# Altium project ElectroSmithES2164.PrjPcb
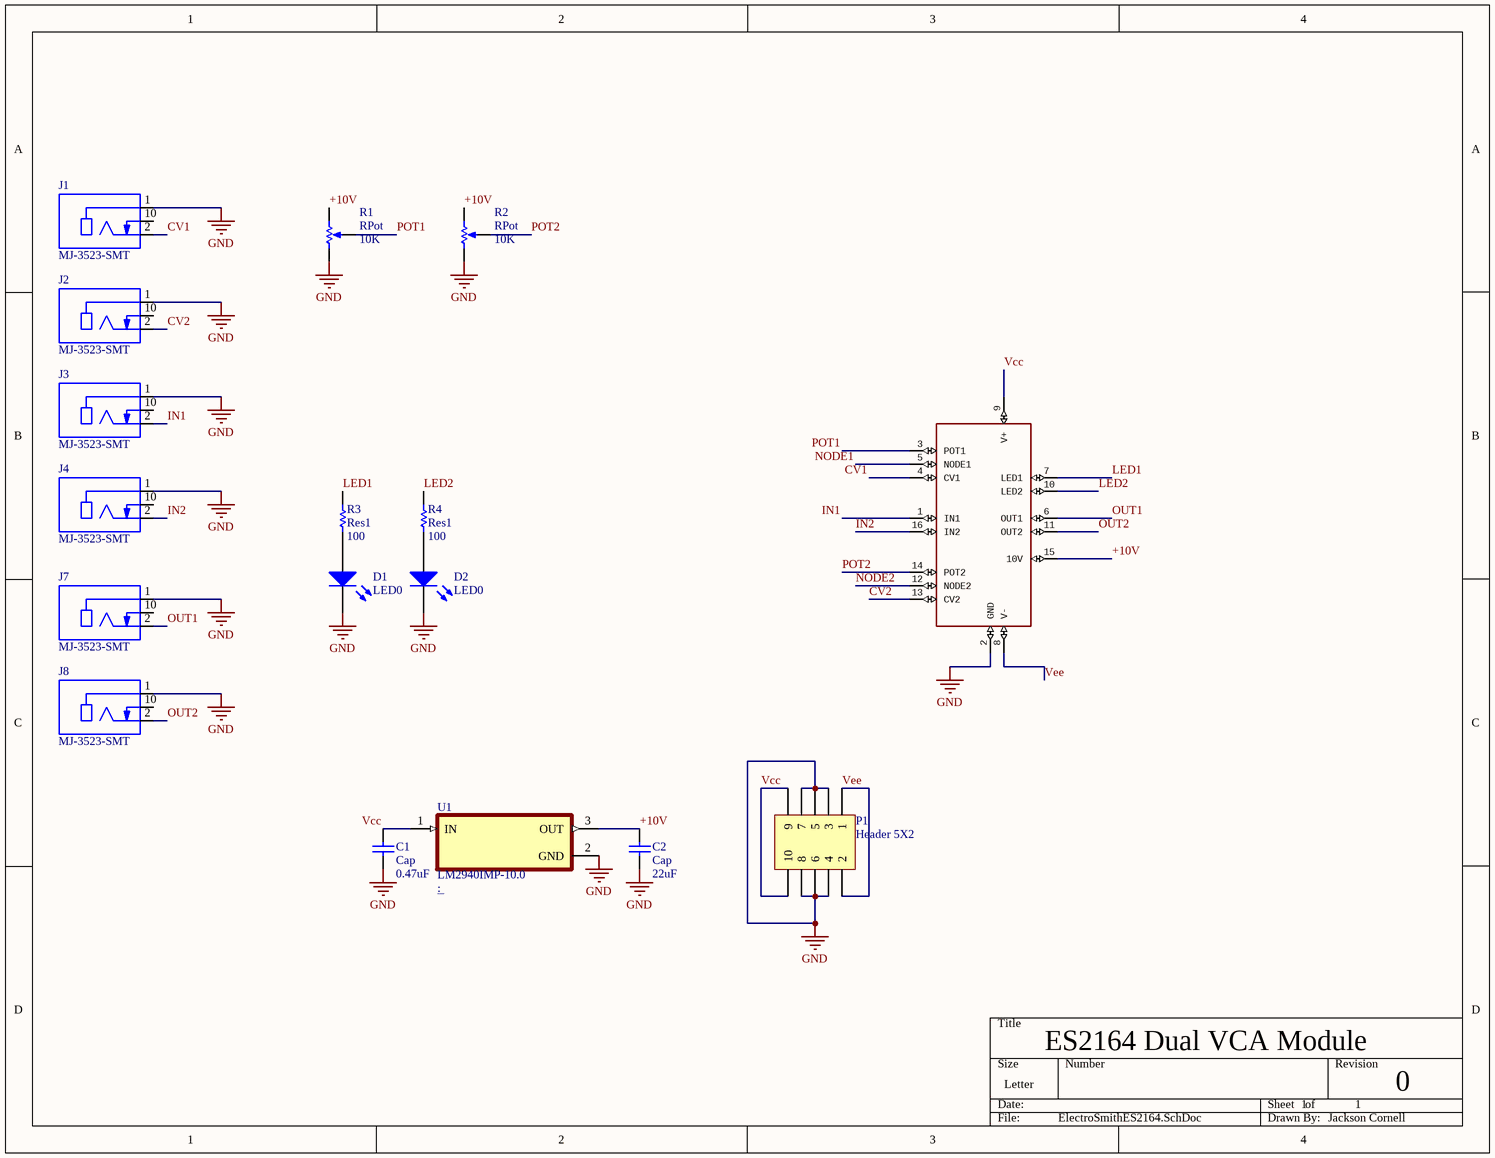
[diagram p0: ElectroSmithES2164.SchDoc]
1 sheet, 17 parts. Net scope: global (net labels, ports and power ports of the same name join across sheets).
Board file: ElectroSmithES2164.PcbDoc

## Sheet ElectroSmithES2164.SchDoc
size Letter

### Parts
C1  Cap  value 0.47uF  [RESC3115X65N]
C2  Cap  value 22uF  [RESC3115X65N]
D1  LED0  [LED-0]
D2  LED0  [LED-0]
J1  MJ-3523-SMT  [ES 3.5mm Jack]
J2  MJ-3523-SMT  [ES 3.5mm Jack]
J3  MJ-3523-SMT  [ES 3.5mm Jack]
J4  MJ-3523-SMT  [ES 3.5mm Jack]
J7  MJ-3523-SMT  [ES 3.5mm Jack]
J8  MJ-3523-SMT  [ES 3.5mm Jack]
P1  Header 5X2  [HDR2X5]
R1  RPot  value 10K  [ES Potentiometer]
R2  RPot  value 10K  [ES Potentiometer]
R3  Res1  value 100  [RESC3115X65N]
R4  Res1  value 100  [RESC3115X65N]
U1  LM2940IMP-10.0  [SOT230P700X180-4N]
U?  Designed for ES_2164_Rev4  [ES_2164_V2]  (value not drawn)

### Nets
GND: C1.2 C2.2 D1.2(K) D2.2(K) J1.1 J2.1 J3.1 J4.1 J7.1 J8.1 P1.3 P1.4 P1.5 P1.6 P1.7 P1.8 R1.1(TOP) R2.1(TOP) U1.2(GND) U?.2(GND)
+10V: C2.1 R1.2(BOT) R2.2(BOT) U1.3(OUT) U?.15(10V)
CV1: J1.2 U?.4(CV1)
CV2: J2.2 U?.13(CV2)
IN1: J3.2 U?.1(IN1)
IN2: J4.2 U?.16(IN2)
LED1: R3.2 U?.7(LED1)
LED2: R4.2 U?.10(LED2)
NODE1: U?.5(NODE1)
NODE2: U?.12(NODE2)
OUT1: J7.2 U?.6(OUT1)
OUT2: J8.2 U?.11(OUT2)
POT1: R1.3(TAP) U?.3(POT1)
POT2: R2.3(TAP) U?.14(POT2)
Vcc: C1.1 P1.9 P1.10 U1.1(IN) U?.9(V+)
Vee: P1.1 P1.2 U?.8(V-)
NetD1_1: D1.1(A) R3.1
NetD2_1: D2.1(A) R4.1

Not connected (* = marked no-connect by the designer): J1 10; J2 10; J3 10; J4 10; J7 10; J8 10

### Notes on the sheet
- ES2164 Dual VCA Module
- 1
- 0
- Jackson Cornell

### Library data of the parts
C1 C2 = Cap: Capacitor; Published: 8-Jun-2000; LatestRevisionDate: 17-Jul-2002; LatestRevisionNote: Re-released for DXP Platform.; PackageReference: RAD-0.3; Publisher: Altium Limited; PackageDescription: Radial Cap, Thru-Hole; 2 Leads; 0.3 in Pin Spacing
D1 D2 = LED0: Typical INFRARED GaAs LED; Published: 8-Jun-2000; LatestRevisionDate: 08-Jul-2005; LatestRevisionNote: Mech Layer 1 removed.; PackageReference: LED-0; Publisher: Altium Limited; PackageDescription: LED; 2 Leads
J1-J4 J7 J8 = MJ-3523-SMT: 3.5 mm, Mono, Right Angle, Surface Mount _SMT_, Audio Jack Connector; MP: MJ-3523-SMT-TR; MF: CUI Devices; CUI_purchase_URL: https://www.cuidevices.com/product/interconnect/connectors/audio-connectors/jacks/mj-3523-smt?utm_source=snapeda.com&utm_medium=referral&utm_campaign=snapedaBOM; Package: None; Price: None; Availability: Unavailable; Value: *; SnapEDA_Link: https://www.snapeda.com/parts/MJ-3523-SMT-TR/CUI%20Devices/view-part/522855/?ref=snap
P1 = Header 5X2: Header, 5-Pin, Dual row; LatestRevisionDate: 17-Jul-2002; LatestRevisionNote: Re-released for DXP Platform.; Publisher: Altium Limited
R1 R2 = RPot: Potentiometer; Sim Note: Enter the Resistance value and the set point into parameter fields.; Set Position: 0.5; Published: 8-Jun-2000; LatestRevisionDate: 17-Jul-2002; LatestRevisionNote: Re-released for DXP Platform.; PackageReference: VR5; Publisher: Altium Limited; PackageDescription: Variable Resistor, Thru-Hole; 3 Leads
R3 R4 = Res1: Resistor; Published: 8-Jun-2000; LatestRevisionDate: 17-Jul-2002; LatestRevisionNote: Re-released for DXP Platform.; PackageReference: AXIAL-0.3; Publisher: Altium Limited; PackageDescription: Axial Device, Thru-Hole; 2 Leads; 0.3 in Pin Spacing
U1 = LM2940T-5.0: 1-A, 26-V, high-PSRR, low-dropout voltage regulator 3-TO-220 -40 to 125; MF: Texas Instruments; Package: TO-220-3 Texas Instruments; DigiKey-Purchase-URL: https://snapeda.com/shop?store=DigiKey&id=533322; Value: *; Mouser-Purchase-URL: https://snapeda.com/shop?store=Mouser&id=533322; Availability: Warning; SnapEDA_Link: https://www.snapeda.com/parts/LM2940T-5.0/Texas%20Instruments/view-part/533322/?ref=snap; MP: LM2940T-5.0; Price: None
U? = ES_2164_V2: GateName_1: G$1; SymbolName_1: ES_2164_V2; LibraryName: Electrosmith_Boards; DeviceSetName: ES_2164_V2; Package: ES_2164_V2